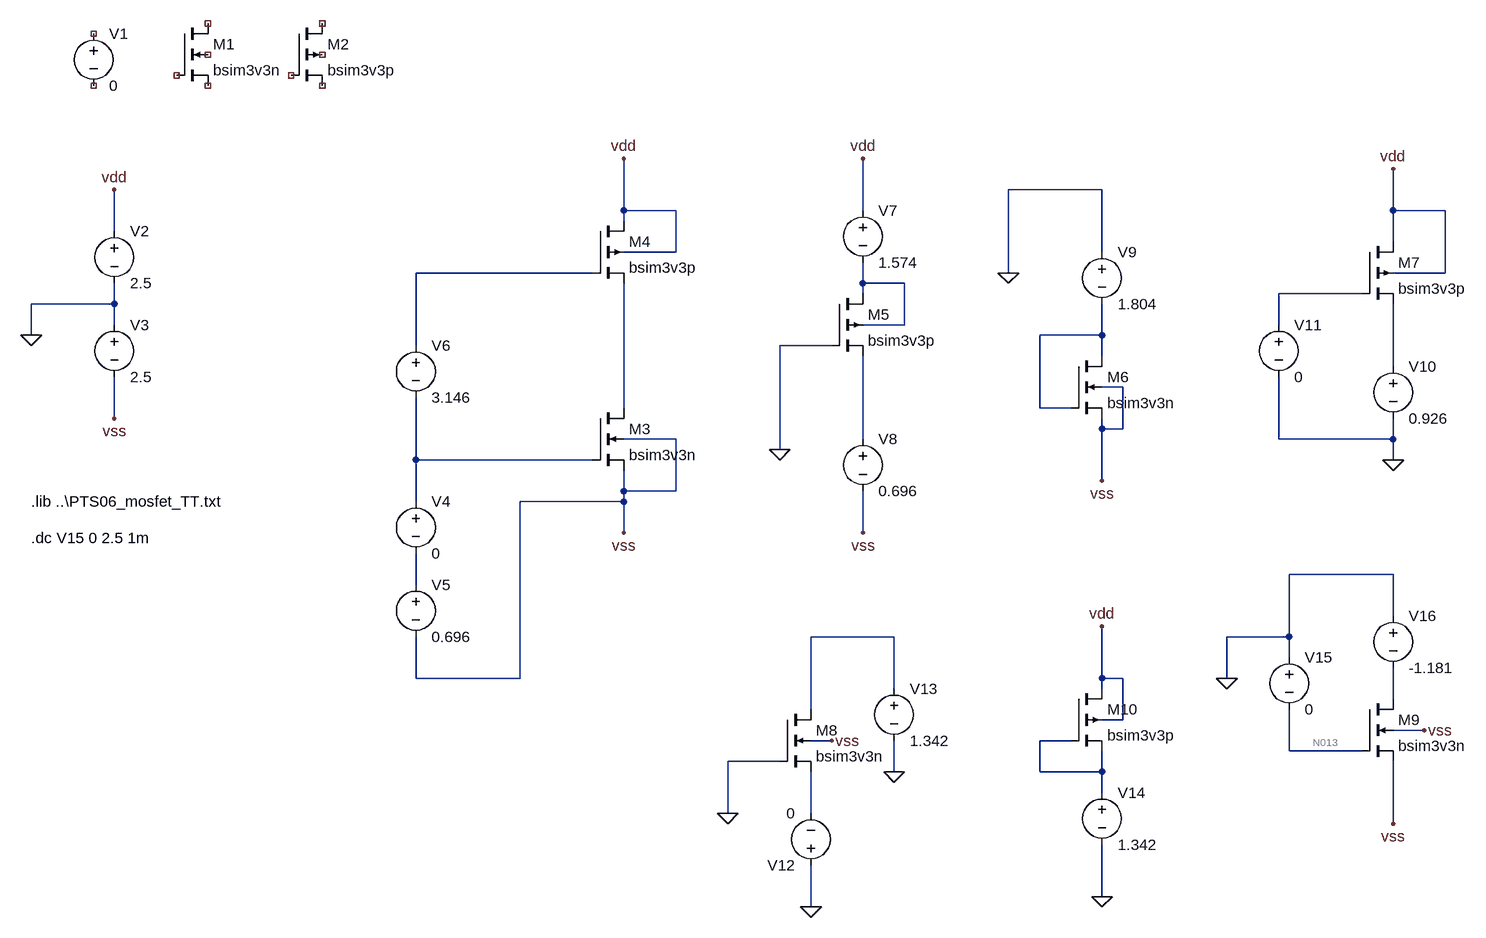
[diagram p0: schematic unit.asc]
unit.asc, the LTspice schematic file:
Version 4
SHEET 1 2796 1428
WIRE 1472 304 1328 304
WIRE 736 336 736 256
WIRE 816 336 736 336
WIRE 1104 336 1104 256
WIRE 1920 336 1920 272
WIRE 2000 336 1920 336
WIRE 736 352 736 336
WIRE -48 368 -48 304
WIRE 1920 384 1920 336
WIRE 816 400 816 336
WIRE 816 400 736 400
WIRE 1472 400 1472 304
WIRE 688 432 416 432
WIRE 1328 432 1328 304
WIRE 2000 432 2000 336
WIRE 2000 432 1920 432
WIRE 1104 448 1104 416
WIRE 1168 448 1104 448
WIRE 1104 464 1104 448
WIRE 1872 464 1744 464
WIRE -48 480 -48 448
WIRE -48 480 -176 480
WIRE -48 512 -48 480
WIRE 1168 512 1168 448
WIRE 1168 512 1104 512
WIRE 1744 512 1744 464
WIRE -176 528 -176 480
WIRE 1472 528 1472 480
WIRE 1472 528 1376 528
WIRE 416 544 416 432
WIRE 1056 544 976 544
WIRE 1472 560 1472 528
WIRE 1920 576 1920 480
WIRE 1504 608 1472 608
WIRE 736 640 736 448
WIRE 1376 640 1376 528
WIRE 1424 640 1376 640
WIRE -48 656 -48 592
WIRE 1472 672 1472 656
WIRE 1504 672 1504 608
WIRE 1504 672 1472 672
WIRE 816 688 736 688
WIRE 1104 688 1104 560
WIRE 1744 688 1744 592
WIRE 1920 688 1920 656
WIRE 1920 688 1744 688
WIRE 976 704 976 544
WIRE 416 720 416 624
WIRE 688 720 416 720
WIRE 1920 720 1920 688
WIRE 1472 752 1472 672
WIRE 736 768 736 736
WIRE 816 768 816 688
WIRE 816 768 736 768
WIRE 416 784 416 720
WIRE 736 784 736 768
WIRE 736 784 576 784
WIRE 736 832 736 784
WIRE 1104 832 1104 768
WIRE 1920 896 1760 896
WIRE 416 912 416 864
WIRE 1920 960 1920 896
WIRE 1152 992 1024 992
WIRE 1760 992 1760 896
WIRE 1760 992 1664 992
WIRE 1760 1024 1760 992
WIRE 416 1056 416 992
WIRE 576 1056 576 784
WIRE 576 1056 416 1056
WIRE 1472 1056 1472 976
WIRE 1504 1056 1472 1056
WIRE 1664 1056 1664 992
WIRE 1152 1072 1152 992
WIRE 1472 1072 1472 1056
WIRE 1920 1088 1920 1040
WIRE 1024 1104 1024 992
WIRE 1504 1120 1504 1056
WIRE 1504 1120 1472 1120
WIRE 1968 1136 1920 1136
WIRE 1056 1152 1024 1152
WIRE 1424 1152 1376 1152
WIRE 1760 1168 1760 1104
WIRE 1872 1168 1760 1168
WIRE 976 1184 896 1184
WIRE 1152 1200 1152 1152
WIRE 1376 1200 1376 1152
WIRE 1472 1200 1472 1168
WIRE 1472 1200 1376 1200
WIRE 1472 1232 1472 1200
WIRE 896 1264 896 1184
WIRE 1024 1264 1024 1200
WIRE 1920 1280 1920 1184
WIRE 1472 1392 1472 1312
WIRE 1024 1408 1024 1344
FLAG -176 528 0
FLAG -48 656 vss
FLAG -48 304 vdd
FLAG 736 256 vdd
FLAG 736 832 vss
FLAG 976 704 0
FLAG 1104 832 vss
FLAG 1104 256 vdd
FLAG 1328 432 0
FLAG 1472 752 vss
FLAG 1920 720 0
FLAG 1920 272 vdd
FLAG 1152 1200 0
FLAG 1024 1408 0
FLAG 896 1264 0
FLAG 1056 1152 vss
FLAG 1472 1392 0
FLAG 1472 976 vdd
FLAG 1664 1056 0
FLAG 1920 1280 vss
FLAG 1968 1136 vss
SYMBOL nmos4 48 48 R0
SYMATTR InstName M1
SYMATTR Value bsim3v3n
SYMBOL pmos4 224 48 R0
SYMATTR InstName M2
SYMATTR Value bsim3v3p
SYMBOL voltage -80 48 R0
WINDOW 123 0 0 Left 0
WINDOW 39 0 0 Left 0
SYMATTR InstName V1
SYMATTR Value 0
SYMBOL voltage -48 352 R0
WINDOW 123 0 0 Left 0
WINDOW 39 0 0 Left 0
SYMATTR InstName V2
SYMATTR Value 2.5
SYMBOL voltage -48 496 R0
WINDOW 123 0 0 Left 0
WINDOW 39 0 0 Left 0
SYMATTR InstName V3
SYMATTR Value 2.5
SYMBOL voltage 416 768 R0
WINDOW 123 0 0 Left 0
WINDOW 39 0 0 Left 0
SYMATTR InstName V4
SYMATTR Value 0
SYMBOL pmos4 688 352 R0
SYMATTR InstName M4
SYMATTR Value bsim3v3p
SYMATTR Value2 l=0.6u w=1.2u m=4
SYMBOL nmos4 688 640 R0
SYMATTR InstName M3
SYMATTR Value bsim3v3n
SYMATTR Value2 l=0.6u w=4u m=4
SYMBOL voltage 416 896 R0
WINDOW 123 0 0 Left 0
WINDOW 39 0 0 Left 0
SYMATTR InstName V5
SYMATTR Value 0.696
SYMBOL voltage 416 528 R0
WINDOW 123 0 0 Left 0
WINDOW 39 0 0 Left 0
SYMATTR InstName V6
SYMATTR Value 3.146
SYMBOL pmos4 1056 464 R0
SYMATTR InstName M5
SYMATTR Value bsim3v3p
SYMATTR Value2 l=0.6u w=1.2u m=4
SYMBOL voltage 1104 320 R0
WINDOW 123 0 0 Left 0
WINDOW 39 0 0 Left 0
SYMATTR InstName V7
SYMATTR Value 1.574
SYMBOL voltage 1104 672 R0
WINDOW 123 0 0 Left 0
WINDOW 39 0 0 Left 0
SYMATTR InstName V8
SYMATTR Value 0.696
SYMBOL voltage 1472 384 R0
WINDOW 123 0 0 Left 0
WINDOW 39 0 0 Left 0
SYMATTR InstName V9
SYMATTR Value 1.804
SYMBOL nmos4 1424 560 R0
SYMATTR InstName M6
SYMATTR Value bsim3v3n
SYMATTR Value2 l=1.9u w=1.2u m=4
SYMBOL pmos4 1872 384 R0
SYMATTR InstName M7
SYMATTR Value bsim3v3p
SYMATTR Value2 l=1.8u w=1.2u m=4
SYMBOL voltage 1920 560 R0
WINDOW 123 0 0 Left 0
WINDOW 39 0 0 Left 0
SYMATTR InstName V10
SYMATTR Value 0.926
SYMBOL voltage 1744 496 R0
WINDOW 123 0 0 Left 0
WINDOW 39 0 0 Left 0
SYMATTR InstName V11
SYMATTR Value 0
SYMBOL nmos4 976 1104 R0
SYMATTR InstName M8
SYMATTR Value bsim3v3n
SYMATTR Value2 l=0.6u w=1.2u m=4
SYMBOL voltage 1024 1360 R180
WINDOW 123 0 0 Left 0
WINDOW 39 0 0 Left 0
SYMATTR InstName V12
SYMATTR Value 0
SYMBOL voltage 1152 1056 R0
WINDOW 123 0 0 Left 0
WINDOW 39 0 0 Left 0
SYMATTR InstName V13
SYMATTR Value 1.342
SYMBOL nmos4 1872 1088 R0
SYMATTR InstName M9
SYMATTR Value bsim3v3n
SYMATTR Value2 l=1.8u w=2.4u m=4
SYMBOL pmos4 1424 1072 R0
SYMATTR InstName M10
SYMATTR Value bsim3v3p
SYMATTR Value2 l=4.4u w=1.2u m=4
SYMBOL voltage 1472 1216 R0
WINDOW 123 0 0 Left 0
WINDOW 39 0 0 Left 0
SYMATTR InstName V14
SYMATTR Value 1.342
SYMBOL voltage 1760 1008 R0
WINDOW 123 0 0 Left 0
WINDOW 39 0 0 Left 0
SYMATTR InstName V15
SYMATTR Value 0
SYMBOL voltage 1920 944 R0
WINDOW 123 0 0 Left 0
WINDOW 39 0 0 Left 0
SYMATTR InstName V16
SYMATTR Value -1.181
TEXT -176 840 Left 2 !.dc V15 0 2.5 1m
TEXT -176 784 Left 2 !.lib ..\\PTS06_mosfet_TT.txt

The netlist it stands for:
* unit.asc
M1 NC_01 NC_02 NC_03 NC_04 bsim3v3n
M2 NC_05 NC_06 NC_07 NC_08 bsim3v3p
V1 NC_09 NC_10 0
V2 vdd 0 2.5
V3 0 vss 2.5
V4 N008 N009 0
M4 vdd N001 N006 vdd bsim3v3p l=0.6u w=1.2u m=4
M3 N006 N008 vss vss bsim3v3n l=0.6u w=4u m=4
V5 N009 vss 0.696
V6 N001 N008 3.146
M5 N002 0 N007 N002 bsim3v3p l=0.6u w=1.2u m=4
V7 vdd N002 1.574
V8 N007 vss 0.696
V9 0 N004 1.804
M6 N004 N004 vss vss bsim3v3n l=1.9u w=1.2u m=4
M7 vdd N003 N005 vdd bsim3v3p l=1.8u w=1.2u m=4
V10 N005 0 0.926
V11 N003 0 0
M8 N010 0 N014 vss bsim3v3n l=0.6u w=1.2u m=4
V12 0 N014 0
V13 N010 0 1.342
M9 N011 N013 vss vss bsim3v3n l=1.8u w=2.4u m=4
M10 vdd N012 N012 vdd bsim3v3p l=4.4u w=1.2u m=4
V14 N012 0 1.342
V15 0 N013 0
V16 0 N011 -1.181
.model NMOS NMOS
.model PMOS PMOS
.lib standard.mos
.dc V15 0 2.5 1m
.lib ..\PTS06_mosfet_TT.txt
.backanno
.end

* Results of the author's LTspice run, read from the files saved beside the schematic
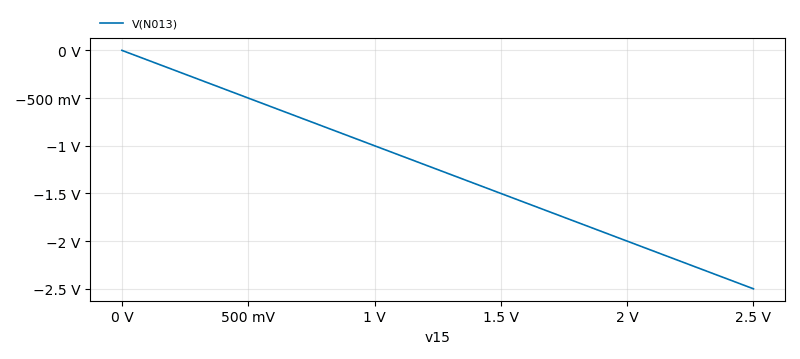
[diagram p1: DC transfer characteristic of unit.asc, plotted from the saved traces]
* DC transfer characteristic, 1 run:
*   V(N013): 0 V at v15=0 V, -2.5 V at v15=2.5 V, min -2.5 V, max 0 V